# EAGLE schematic transformator (EAGLE 7.7.0)
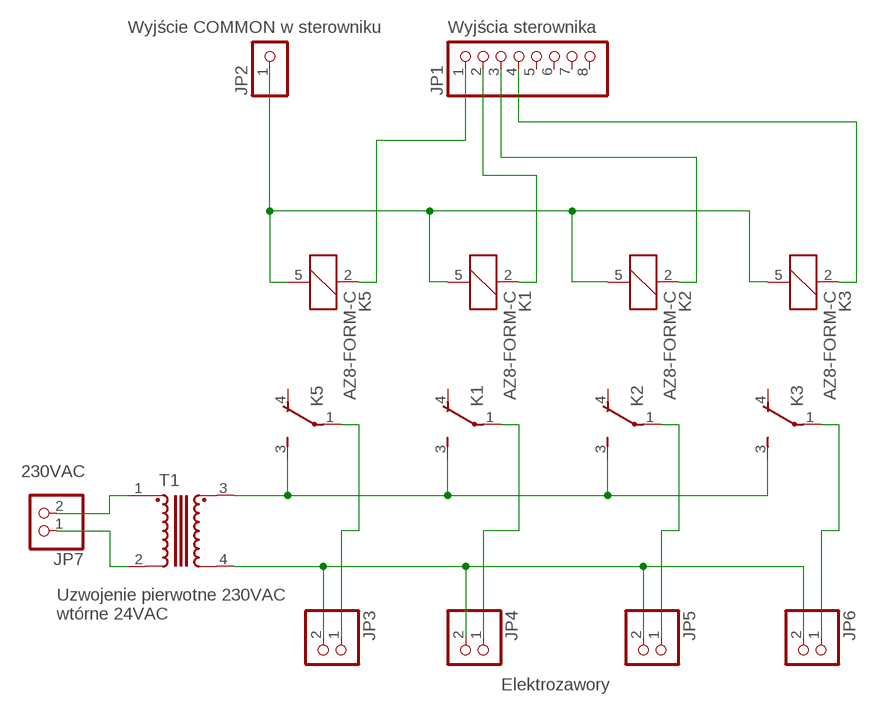
[diagram p0: schematic, sheet 1]

## Parts
JP1  PINHD-1X8LOCK  [1X08-LOCK]
JP2  PINHD-1X1  [1X01]
JP3  PINHD-1X2  [1X02]
JP4  PINHD-1X2  [1X02]
JP5  PINHD-1X2  [1X02]
JP6  PINHD-1X2  [1X02]
JP7  PINHD-1X2  [1X02]
K1  AZ8-FORM-C  [AZ8]
K2  AZ8-FORM-C  [AZ8]
K3  AZ8-FORM-C  [AZ8]
K5  AZ8-FORM-C  [AZ8]
T1  SP-33  [REDSPEC-1]

## Nets
N$1: JP2.1 K1.5 K5.5
N$2: JP1.1 K5.2
N$3: JP1.2 K1.2
N$4: JP1.3
N$5: JP1.4
N$6: JP3.2 JP4.2 JP5.2 JP6.2 T1.4
N$7: JP3.1 K5.1(-1:P)
N$8: JP4.1 K1.1(-1:P)
N$9: JP5.1 K2.1(-1:P)
N$10: JP6.1 K3.1(-1:P)
N$12: JP7.2 T1.1
N$13: JP7.1 T1.2
N$14: K1.3(-1:S) K2.3(-1:S) K3.3(-1:S) K5.3(-1:S) T1.3
Unconnected: JP1.5 JP1.6 JP1.7 JP1.8 K1.4(-1:O) K2.2 K2.4(-1:O) K2.5 K3.2 K3.4(-1:O) K3.5 K5.4(-1:O)

## Notes on the sheet
- Wyjście COMMON w sterowniku | Wyjścia sterownika
- 230VAC
- Uzwojenie pierwotne 230VAC
  wtórne 24VAC
- Elektrozawory

## Library data of the parts
JP1 = adafruit:PINHD-1X8: PIN HEADER
JP2 = adafruit:PINHD-1X1: Pin header 1x1 for 0.1" spacing With round pins
JP3-JP7 = pinhead:PINHD-1X2: PIN HEADER
K1-K3 K5 = relay:AZ8-FORM-C: MINIATURE PC BOARD RELAY Form C Source: www.azettler.com .. AZ8-1ch-12DSE.PDF; OC_FARNELL: unknown; OC_NEWARK: unknown
T1 = trafo-triad:SP-33: AUDIO TRANSFORMER Red Spec Series